# Altium schematic sheet uartjtag_block.SchDoc
size A4
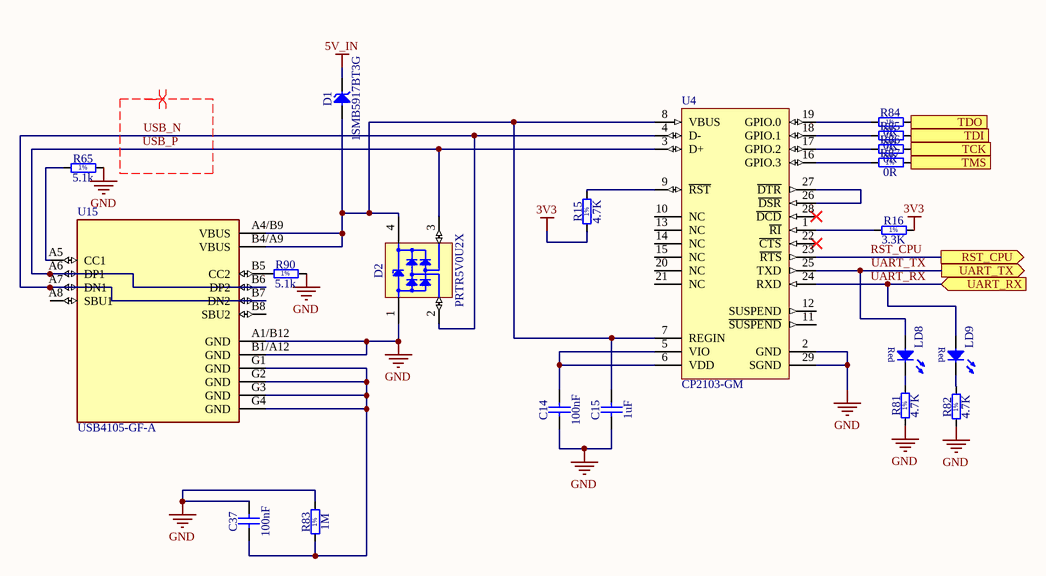
[diagram p0: uartjtag_block.SchDoc]

## Parts
C14  100nF  [CAPC2013X100N]
C15  1uF  [CAPC2013X100N]
C37  100nF  [CAPC2013X100N]
D1  1SMB5917BT3G  [DIOM5436X244N]
D2  PRTR5V0U2X  [SOT190P230X110-4N]
LD8  Super Red  [LED_OSRAM_LSR976]  (value not drawn)
LD9  Super Red  [LED_OSRAM_LSR976]  (value not drawn)
R15  4.7K  [RESC1608X55N]
R16  3.3K  [RESC1608X55N]
R65  5.1k  [RESC1608X55N]
R81  4.7K  [RESC1608X55N]
R82  4.7K  [RESC1608X55N]
R83  1M  [RESC1608X55N]
R84  0R  [RESC1608X55N]
R85  0R  [RESC1608X55N]
R86  0R  [RESC1608X55N]
R87  0R  [RESC1608X55N]
R90  5.1k  [RESC1608X55N]
U4  CP2103-GM  [SLAB-QFN-28-3125x3125TP_A_L]
U15  USB4105-GF-A  [GCT_USB4105-GF-A]

## Ports
RST_CPU (out), TCK (out), TDI (out), TDO (in), TMS (out), UART_RX (in), UART_TX (out)

## Nets
3V3: R15.1 R16.2
5V_IN: D1.1(C)
GND: C14.1 C15.1 C37.2 D2.1(GND) R65.2 R81.1 R82.1 R83.2 R90.2 U4.2(GND) U4.29(SGND) U15.A1/B12(GND) U15.B1/A12(GND)
RST_CPU: U4.23(~{RTS}) ; port RST_CPU
TCK: R86.2 ; port TCK
TDI: R85.2 ; port TDI
TDO: R84.2 ; port TDO
TMS: R87.2 ; port TMS
UART_RX: LD9.2(A) U4.24(RXD) ; port UART_RX
UART_TX: LD8.2(A) U4.25(TXD) ; port UART_TX
USB_N: D2.2(I/O1) U4.4(D-) U15.A7(DN1) U15.B7(DN2)
USB_P: D2.3(I/O2) U4.3(D+) U15.A6(DP1) U15.B6(DP2)
NetC14_2: C14.2 U4.5(VIO) U4.6(VDD)
NetC15_2: C15.2 D1.2(A) D2.4(VCC) U4.7(REGIN) U4.8(VBUS) U15.A4/B9(VBUS) U15.B4/A9(VBUS)
NetC37_1: C37.1 R83.1 U15.G1(GND) U15.G2(GND) U15.G3(GND) U15.G4(GND)
NetLD8_1: LD8.1(C) R81.2
NetLD9_1: LD9.1(C) R82.2
NetR15_2: R15.2 U4.9(~{RST})
NetR16_1: R16.1 U4.1(~{RI})
NetR65_1: R65.1 U15.A5(CC1)
NetR84_1: R84.1 U4.19(GPIO.0)
NetR85_1: R85.1 U4.18(GPIO.1)
NetR86_1: R86.1 U4.17(GPIO.2)
NetR87_1: R87.1 U4.16(GPIO.3)
NetR90_1: R90.1 U15.B5(CC2)
NetU4_26: U4.26(~{DSR}) U4.27(~{DTR})

Not connected (* = marked no-connect by the designer): U4 10(NC) 11(~{SUSPEND}) 12(SUSPEND) 13(NC) 14(NC) 15(NC) 20(NC) 21(NC) 22(~{CTS})* 28(~{DCD})*; U15 A8(SBU1) B8(SBU2)

## Layout directives
differential pair; net class USB_LINES; rule Differential Pairs Routing [Pref Gap = 0.2mm    Min Gap  = 0.2mm    Max Gap  = 0.3mmPref Width = 0.2mm    Min Width  = 0.2mm    Max Width  = 0.3mm]: USB_N, USB_P

## Notes on the sheet
- (in symbol LED_OSRAM_LSR976) Red
- (in symbol R0603_100K_1%_0.1W_100PPM) 1%

## Library data of the parts
C14 C15 C37 = CC0805_1.5NF_50V_5%_C0G: Non-polarised capacitor; Part Description: SMD Multilayer Chip Ceramic Capacitor; Manufacturer: GENERIC; Manufacturer1 Part Number: C0805C152J5GACTU; Value: 1.5nF; Voltage: 50V; TC: C0G/NP0; Tolerance: ±5%; Part Number: CC0805_1.5NF_50V_5%_C0G; Component Kind: Standard; Component Type: Standard; Pin Count: 2; Status: Preferred; Manufacturer Part Number: CC0805_1.5NF_50V_5%_C0G; Case: 0805; Mounted: Yes; Socket: No; SMD: Yes; Sense: No; Manufacturer1 Example: KEMET; Manufacturer1 ComponentHeight: 1mm; HelpURL: \\cern.ch\dfs\Applications\Altium\Datasheets\CC0805_C0G_KEMET_(Commercial Grade).pdf; Author: CERN DEM BC; CreateDate: 18.11.2015; LatestRevisionDate: 18.11.2015
D1 = 1SMB5917BT3G: Zener Diode; Part Description: Plastic Surface Mount Zener Voltage Regulator Diode; Manufacturer: ON SEMICONDUCTOR; Voltage: 4.7V; Power: 3W; PressFit: No; Bonding: No; Part Number: 1SMB5917BT3G; Component Kind: Standard; Component Type: Standard; Device: 1SMB5917BT3G; PackageDescription: DO-214-AA/SMB Diode, Molded Body; 5.40mm L X 3.62mm W X 2.44mm H, IPC Medium Density; Manufacturer Part Number: 1SMB5917BT3G; Pin Count: 2; Case: SMB; Mounted: Yes; Socket: No; SMD: Yes; Sense: No; ComponentHeight: 2.44mm; HelpURL: \\cern.ch\dfs\Applications\Altium\Datasheets\1SMB5917BT3G.pdf; Author: CERN DEM MR; CreateDate: 05.09.2016; LatestRevisionDate: 05.09.2016
D2 = PRTR5V0U2X: Ultra Low Capacitance Double Rail-to-Rail ESD Protection Diode; Part Description: Ultra Low Capacitance (1pF) Double Rail-to-Rail ESD Protection Diode (8kV); Manufacturer: NXP SEMICONDUCTORS; Voltage: 5.5V; PressFit: No; Bonding: No; Part Number: PRTR5V0U2X; Component Kind: Standard; Component Type: Standard; Device: PRTR5V0U2X; PackageDescription: SOT143B, SOT, 1.90mm Pitch; 4 Pin, 1.30mm W X 2.90mm L X 1.10mm H body, IPC Medium Density; Manufacturer Part Number: PRTR5V0U2X; Pin Count: 4; Case: SOT143B; Mounted: Yes; Socket: No; SMD: Yes; Sense: No; ComponentHeight: 1.1mm; HelpURL: \\cern.ch\dfs\Applications\Altium\Datasheets\PRTR5V0U2X.pdf; Author: CERN DEM JLC; CreateDate: 22.03.2011; LatestRevisionDate: 22.03.2011
LD8 LD9 = LED_OSRAM_LSR976: LED Red 1C 2A; Part Description: Surface Mount Super Red LED (0805 Case); Manufacturer: OSRAM; Manufacturer Part Number: LSR976; PressFit: No; Bonding: No; Part Number: LED_OSRAM_LSR976; Component Kind: Standard; Component Type: Standard; Color: Super Red; PackageDescription: Super Red Chip LED, 2-Leads, Body 2 x1.25mm, IPC Medium Density; Pin Count: 2; Case: 0805; Mounted: Yes; Socket: No; SMD: Yes; Sense: No; ComponentHeight: 0.9mm; HelpURL: \\cern.ch\dfs\Applications\Altium\Datasheets\LED_OSRAM_LSR976.pdf; Author: CERN DEM JLC; CreateDate: 18.05.2010; LatestRevisionDate: 18.05.2010
R15 R16 R65 R81-R87 R90 = R0603_100K_1%_0.1W_100PPM: Resistor - 1%; Part Description: General Purpose Thick Film Chip Resistor; Manufacturer: GENERIC; Manufacturer1 Part Number: NRC06F1003TRF; Value: 100k; Power: 0.1W; TC: ±100ppm/°C; PressFit: No; Part Number: R0603_100K_1%_0.1W_100PPM; Component Kind: Standard; Component Type: Standard; Pin Count: 2; Status: Preferred; Tolerance: ±1%; Manufacturer Part Number: R0603_100K_1%_0.1W_100PPM; Case: 0603; Mounted: Yes; Sense: No; Socket: No; SMD: Yes; Manufacturer1 Example: NIC COMPONENT; Manufacturer1 ComponentHeight: 0.55mm; HelpURL: \\cern.ch\dfs\Applications\Altium\Datasheets\R0603_NIC_NRC.pdf; Author: CERN DEM JLC; CreateDate: 03.12.2007; LatestRevisionDate: 13.03.2008
U4 = CP2103-GM: Single-Chip USB to UART Bridge, 1024 Bytes EEPROM, -40 to 85 degC, 28-pin QFN, Tube; Manufacturer: Silicon Labs; Internal Oscillator: TRUE; Sub-Family: USB Bridges; DatasheetVersion: Rev. 1.0; PackageReference: QFN-28; PackageDescription: 28-Pin Quad-Flat No-Leads Package, Body 5 x 5 mm, Pitch 0.5 mm; Supplier 1: Digi-Key; Supplier Part Number 1: 336-1164-ND; Supplier 2: Farnell; Supplier Part Number 2: 1291538; Supplier 3: Newark; Supplier Part Number 3: 24M1109; Supplier 4: Mouser; Supplier Part Number 4: 634-CP2103-GM; EEPROM: 1024 Bytes; Mounting Technology: Surface Mount; PartNumber: CP2103-GM; ComponentLink1Description: Manufacturer URL; ComponentLink1URL: http://www.silabs.com/; ComponentLink2Description: Datasheet; ComponentLink2URL: http://www.silabs.com/Support%20Documents/TechnicalDocs/CP2103.pdf; ComponentLink3Description: Package Specification; ComponentLink3URL: http://www.silabs.com/Support%20Documents/TechnicalDocs/C8051F35x.pdf
U15 = USB4105-GF-A: USB-C _USB TYPE-C_ USB 2.0 Receptacle Connector 24 _16+8 Dummy_ Position Surface Mount, Right Angle; Through Hole; MF: GCT; SnapEDA_Link: https://www.snapeda.com/parts/USB4105-GF-A/Global%20Connector%20Technology/view-part/4423780/?ref=snap; Price: None; Availability: Unavailable; Package: None; MP: USB4105-GF-A; Value: *